# EAGLE design servo_circuit (EAGLE 7.7.0)
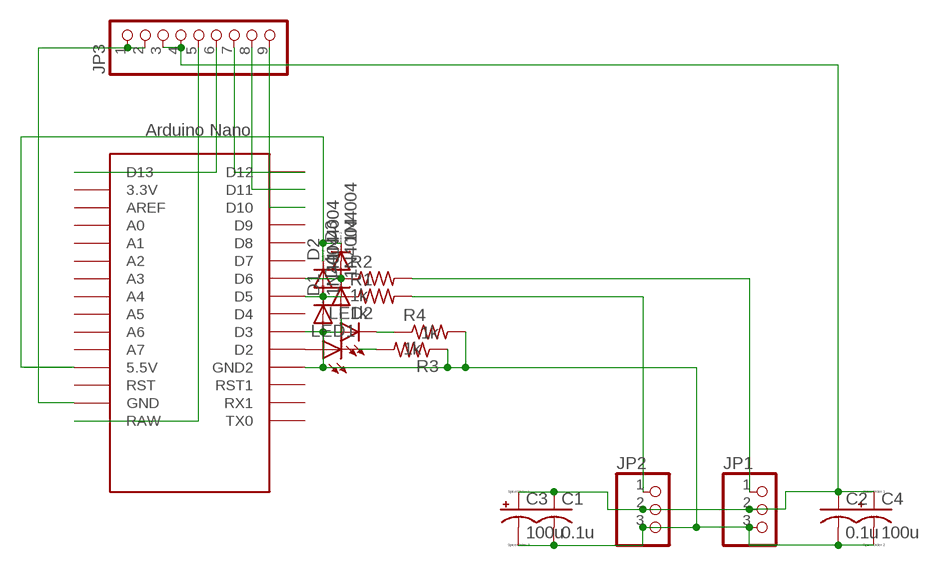
[diagram p0: schematic, sheet 1]

## Parts
C1  0.1u  C-US050-024X044  [C050-024X044]
C2  0.1u  C-US050-024X044  [C050-024X044]
C3  100u  CPOL-USTT2D5  [TT2D5]
C4  100u  CPOL-USTT2D5  [TT2D5]
D1  1N4004  [DO41-10]
D2  1N4004  [DO41-10]
D3  1N4004  [DO41-10]
D4  1N4004  [DO41-10]
JP1  PINHD-1X3  [1X03]
JP2  PINHD-1X3  [1X03]
JP3  PINHD-1X9  [1X09]
LED1  LED3MM  [LED3MM]
LED2  LED3MM  [LED3MM]
R1  1k  R-US_0309/V  [0309V]
R2  1k  R-US_0309/V  [0309V]
R3  1k  R-US_0309/V  [0309V]
R4  1k  R-US_0309/V  [0309V]
U$1  NANO  [NANO]

## Nets
N$1: LED1.A U$1.D2
N$2: JP3.1 JP3.2 U$1.GND
N$3: C1.1 C2.1 C3.+ C4.+ JP1.2 JP2.2 JP3.3 JP3.4
N$4: LED2.A U$1.D3
N$5: JP2.1 R1.2
N$6: JP1.1 R2.2
N$7: D1.C D2.A R1.1 U$1.D5
N$8: D3.A D4.C R2.1 U$1.D6
N$9: D2.C D3.C U$1.5V(5.5V)
N$10: C1.2 C2.2 C3.- C4.- D1.A D4.A JP1.3 JP2.3 R3.1 R4.2 U$1.GND1(GND2)
N$11: LED2.K(C) R4.1
N$12: JP3.5 U$1.RAW
N$13: JP3.6 U$1.D13
N$14: JP3.7 U$1.D12
N$15: JP3.8 U$1.D11
N$16: JP3.9 U$1.D10
N$17: LED1.K(C) R3.2
Unconnected: U$1.3.3V U$1.A0 U$1.A1 U$1.A2 U$1.A3 U$1.A4 U$1.A5 U$1.A6 U$1.A7 U$1.AREF U$1.D4 U$1.D7 U$1.D8 U$1.D9 U$1.ICSP1 U$1.ICSP2 U$1.ICSP3 U$1.ICSP4 U$1.ICSP5 U$1.ICSP6 U$1.RST U$1.RST1 U$1.RX1 U$1.TX0

## Library data of the parts
C1 C2 = resistor:C-US: CAPACITOR, American symbol
C3 C4 = resistor:CPOL-US: POLARIZED CAPACITOR, American symbol
D1-D4 = diode:1N4004: DIODE general purpose rectifier, 1 A
JP1 JP2 = pinhead:PINHD-1X3: PIN HEADER
JP3 = pinhead:PINHD-1X9: PIN HEADER
LED1 LED2 = adafruit:LED: LED OSRAM: - CHIPLED LG R971, LG N971, LY N971, LG Q971, LY Q971, LO R971, LY R971 LH N974, LH R974 LS Q976, LO Q976, LY Q976 LO Q996 - Hyper CHIPLED LW Q18S LB Q993, LB Q99A, LB R99A - SideLED LS A670, LO A670, LY A670, LG A670, LP A670 LB A673, LV A673, LT A673, LW A673 LH A674 LY A675 LS A676, LA A676, LO A676, LY A676, LW A676 LS A679, LY A679, LG A679 - Hyper Micro SIDELED® LS Y876, LA Y876, LO Y876, LY Y876 LT Y87S - SmartLED LW L88C, LW L88S LB L89C, LB L89S, LG L890 LS L89K, LO L89K, LY L89K LS L896, LA L896, LO L896, LY L896 - TOPLED LS T670, LO T670, LY T670, LG T670, LP T670 LSG T670, LSP T670, LSY T670, LOP T670, LYG T670 LG T671, LOG T671, LSG T671 LB T673, LV T673, LT T673, LW T673 LH T674 LS T676, LA T676, LO T676, LY T676, LB T676, LH T676, LSB T676, LW T676 LB T67C, LV T67C, LT T67C, LS T67K, LO T67K, LY T67K, LW E67C LS E67B, LA E67B, LO E67B, LY E67B, LB E67C, LV E67C, LT E67C LW T67C LS T679, LY T679, LG T679 LS T770, LO T770, LY T770, LG T770, LP T770 LB T773, LV T773, LT T773, LW T773 LH T774 LS E675, LA E675, LY E675, LS T675 LS T776, LA T776, LO T776, LY T776, LB T776 LHGB T686 LT T68C, LB T68C - Hyper Mini TOPLED® LB M676 - Mini TOPLED Santana® LG M470 LS M47K, LO M47K, LY M47K Source: http://www.osram.convergy.de/
R1-R4 = resistor:R-US_: RESISTOR, American symbol
U$1 = Arduino-clone:NANO: Arduino Nano

## Board
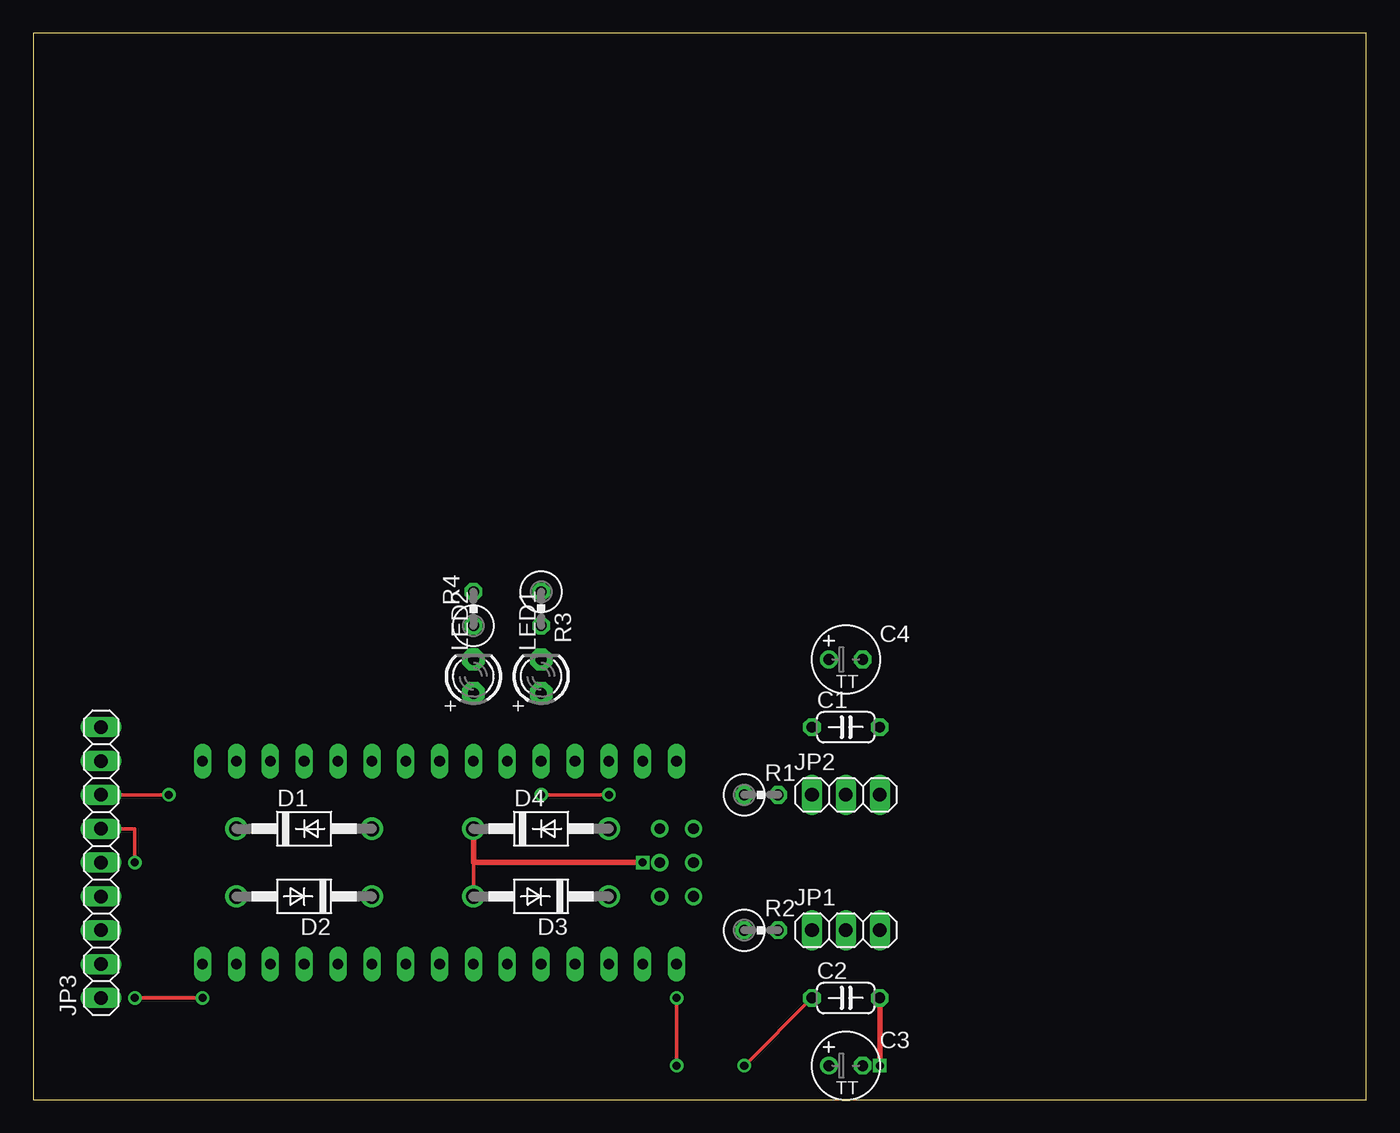
[diagram p1: board, top side]
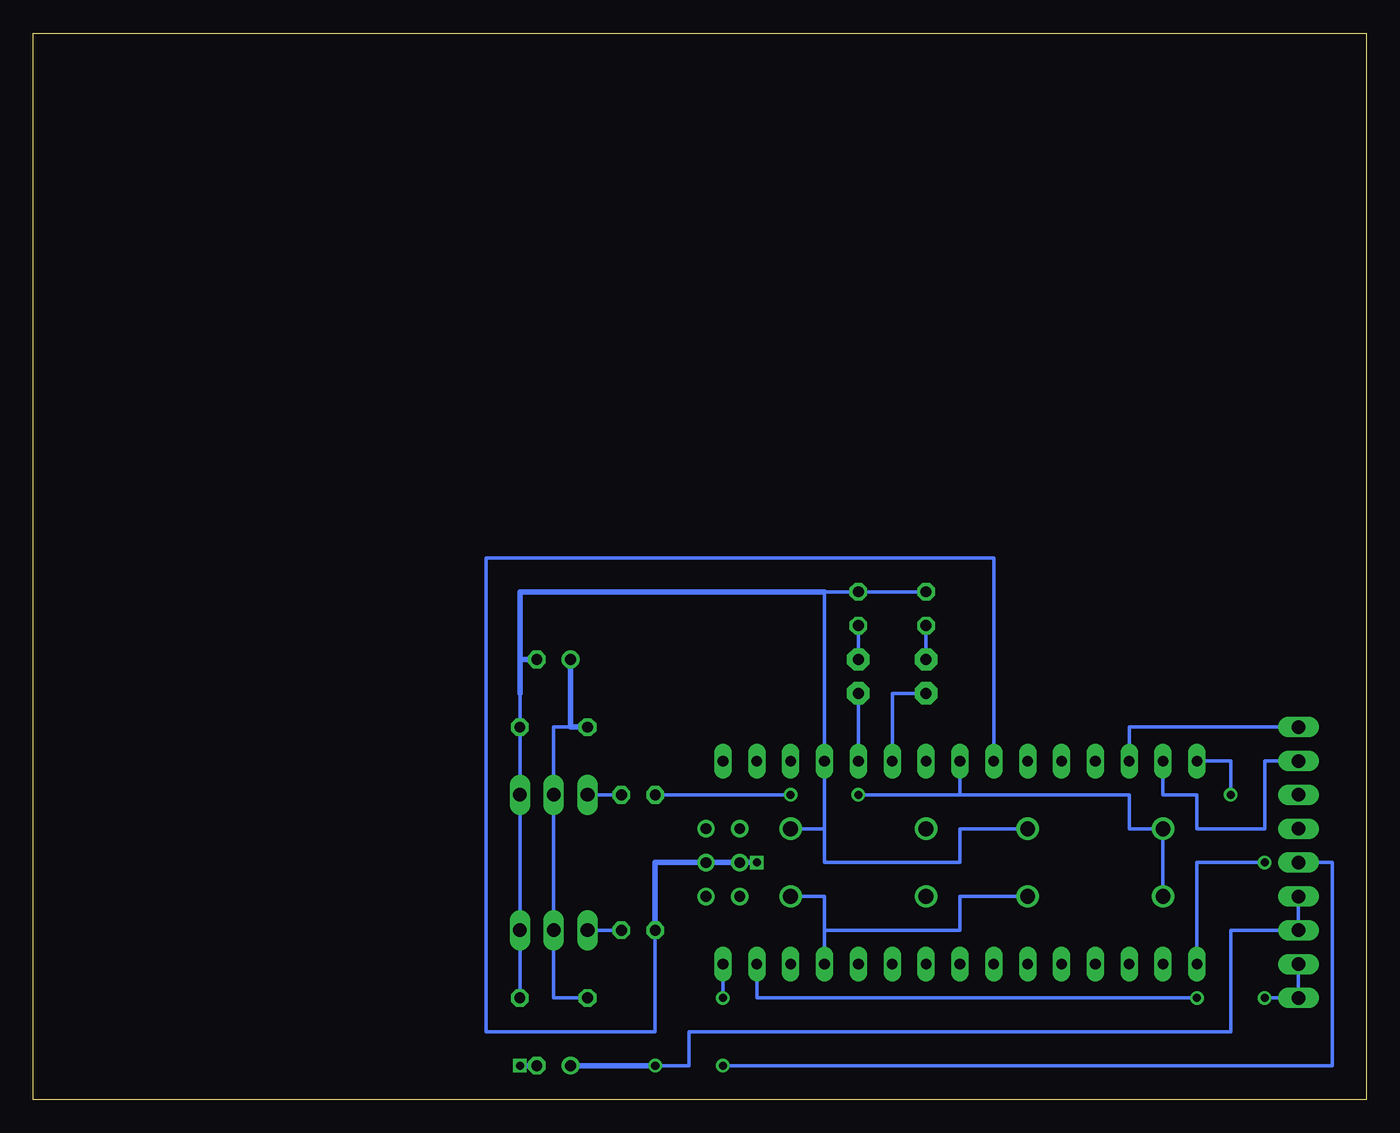
[diagram p2: board, bottom side, seen from below]

Size 100 x 80 mm. Coordinates in mm from the lower left corner, seen from the top.
Outline: 0,0 100,0 100,80 0,80 0,0
Copper layers (1*16): Top 0.035mm / dielectric 1.5mm / Bottom 0.035mm
Design rules "default": minimum track width 10mil, minimum drill 24mil, track to track 8mil, track to pad 8mil, pad to pad 8mil, via to via 8mil, smd to smd 8mil, copper to edge 40mil, drill to drill 8mil, minimum pad ring 10mil, minimum via ring 8mil, stop-mask expansion 4mil, vias tented up to drill 0mil, thermal gap 10mil
tRestrict: area 35.3,32.8 to 35.8,33.3; area 35.3,35.3 to 35.8,35.8; area 40.4,32.8 to 40.9,33.3; area 40.4,35.3 to 40.9,35.8; area 40.4,37.8 to 40.9,38.4; area 35.3,37.8 to 35.8,38.4; area 35.3,40.4 to 35.8,40.9; area 40.4,40.4 to 40.9,40.9; area 64.5,32.8 to 65,33.3; area 62,32.8 to 62.5,33.3; area 65.8,27.7 to 66.3,28.2; area 60.7,27.7 to 61.2,28.2; 72 more areas
bRestrict: area 1,1 to 1.5,1.5; area 1,3.6 to 1.5,4.1; area 3.6,1 to 4.1,1.5; area 3.6,3.6 to 4.1,4.1; area 6.1,1 to 6.6,1.5; area 6.1,3.6 to 6.6,4.1; area 8.6,1 to 9.1,1.5; area 8.6,3.6 to 9.1,4.1; area 11.2,1 to 11.7,1.5; area 11.2,3.6 to 11.7,4.1; area 13.7,1 to 14.2,1.5; area 13.7,3.6 to 14.2,4.1; 1268 more areas

### Footprints (pad centres in the part's own frame; a part is rotated, then mirrored left to right if it is on the bottom)
C050-024X044 = drill 0.813 octagon: 1 -2.54,0; 2 2.54,0
TT2D5 = drill 0.813: + -1.27,0 | drill 0.813 octagon: - 1.27,0
DO41-10 = drill 1.118: A 5.08,0; C -5.08,0
1X03 = drill 1.016 long: 1 -2.54,0; 2 0,0; 3 2.54,0
1X09 = drill 1.016 long: 1 -10.16,0; 2 -7.62,0; 3 -5.08,0; 4 -2.54,0; 5 0,0; 6 2.54,0; 7 5.08,0; 8 7.62,0; 9 10.16,0
LED3MM = drill 0.813 pad 1.676 octagon: A -1.27,0; K 1.27,0
0309V = drill 0.813 octagon: 1 -1.27,0; 2 1.27,0
NANO = drill 0.8 long: 3.3V -10.16,24.13; 5V -10.16,-1.27; A0 -10.16,19.05; A1 -10.16,16.51; A2 -10.16,13.97; A3 -10.16,11.43; A4 -10.16,8.89; A5 -10.16,6.35; A6 -10.16,3.81; A7 -10.16,1.27; AREF -10.16,21.59; D2 5.08,1.27; D3 5.08,3.81; D4 5.08,6.35; D5 5.08,8.89; D6 5.08,11.43; D7 5.08,13.97; D8 5.08,16.51; D9 5.08,19.05; D10 5.08,21.59; D11 5.08,24.13; D12 5.08,26.67; D13 -10.16,26.67; GND -10.16,-6.35; GND1 5.08,-1.27; RAW -10.16,-8.89; RST -10.16,-3.81; RST1 5.08,-3.81; RX1 5.08,-6.35; TX0 5.08,-8.89 | drill 0.8: ICSP1 -5.08,-10.16; ICSP2 -5.08,-7.62; ICSP3 -2.54,-10.16; ICSP4 -2.54,-7.62; ICSP5 0,-10.16; ICSP6 0,-7.62

### Placement (x,y rotation side)
C1  60.96,27.94 0 top
C2  60.96,7.62 0 top
C3  60.96,2.54 0 top
C4  60.96,33.02 0 top
D1  20.32,20.32 0 top
D2  20.32,15.24 180 top
D3  38.1,15.24 180 top
D4  38.1,20.32 0 top
JP1  60.96,12.7 0 top
JP2  60.96,22.86 0 top
JP3  5.08,17.78 90 top
LED1  38.1,31.75 90 top
LED2  33.02,31.75 90 top
R1  54.61,22.86 0 top
R2  54.61,12.7 0 top
R3  38.1,36.83 270 top
R4  33.02,36.83 90 top
U$1  39.37,20.32 90 top

### Tracks (layer width: path | path; a pad name or v marks a point on that pad's centre or on a via)
N$1
  Bottom 0.254: LED1.A U$1.D2
N$2  (via drill 0.61)
  Top 0.254: v7.62,7.62 v12.7,7.62
  Bottom 0.254: U$1.GND 45.72,7.62 v12.7,7.62 | v7.62,7.62 JP3.1 JP3.2
N$3  (via drill 0.61)
  Top 0.254: C2.1 v53.34,2.54
  Bottom 0.254: JP3.4 JP3.3 10.16,12.7 10.16,5.08 50.8,5.08 50.8,2.54 v53.34,2.54 | C1.1 60.96,27.94 JP2.2 JP1.2 60.96,7.62 C2.1
  Bottom 0.406: C3.+ v53.34,2.54 | C1.1 59.69,27.94 C4.+
N$4
  Bottom 0.254: U$1.D3 35.56,30.48 LED2.A
N$5
  Bottom 0.254: JP2.1 R1.2
N$6
  Bottom 0.254: JP1.1 R2.2
N$7  (via drill 0.61)
  Top 0.254: v38.1,22.86 v43.18,22.86
  Bottom 0.254: D2.A D1.C 17.78,20.32 17.78,22.86 30.48,22.86 | 30.48,22.86 U$1.D5 | v43.18,22.86 R1.1 | 30.48,22.86 v38.1,22.86
N$8  (via drill 0.6)
  Top 0.254: 33.02,17.78 D3.A
  Top 0.406: D4.C 33.02,17.78 v45.72,17.78
  Bottom 0.254: U$1.D6 27.94,40.64 66.04,40.64 66.04,5.08 53.34,5.08 R2.1
  Bottom 0.406: v45.72,17.78 53.34,17.78 R2.1
N$9
  Bottom 0.254: 40.64,12.7 40.64,15.24 D3.C | 40.64,12.7 U$1.5V | D2.C 30.48,15.24 30.48,12.7 40.64,12.7
N$10  (via drill 0.6)
  Top 0.406: v63.5,2.54 C2.2
  Bottom 0.254: 40.64,20.32 U$1.GND1 40.64,38.1 R3.1 R4.2 | D4.A 40.64,20.32 | D1.A 30.48,20.32 30.48,17.78 40.64,17.78 40.64,20.32 | C2.2 JP1.3 JP2.3 C1.2 63.5,30.48
  Bottom 0.406: C3.- v63.5,2.54 | 63.5,30.48 63.5,33.02 | 40.64,38.1 63.5,38.1 63.5,33.02 | 63.5,33.02 C4.-
N$11
  Bottom 0.254: LED2.K R4.1
N$12  (via drill 0.61)
  Top 0.254: v48.26,2.54 v48.26,7.62
  Bottom 0.254: v48.26,7.62 U$1.RAW | v48.26,2.54 2.54,2.54 2.54,17.78 JP3.5
N$13  (via drill 0.61)
  Top 0.254: v7.62,17.78 7.62,20.32 JP3.6
  Bottom 0.254: v7.62,17.78 12.7,17.78 U$1.D13
N$14  (via drill 0.61)
  Top 0.254: JP3.7 v10.16,22.86
  Bottom 0.254: U$1.D12 10.16,25.4 v10.16,22.86
N$15
  Bottom 0.254: U$1.D11 15.24,22.86 12.7,22.86 12.7,20.32 7.62,20.32 7.62,25.4 JP3.8
N$16
  Bottom 0.254: JP3.9 17.78,27.94 U$1.D10
N$17
  Bottom 0.254: LED1.K R3.2